# EAGLE design controller_v0 (EAGLE 7.3.0)
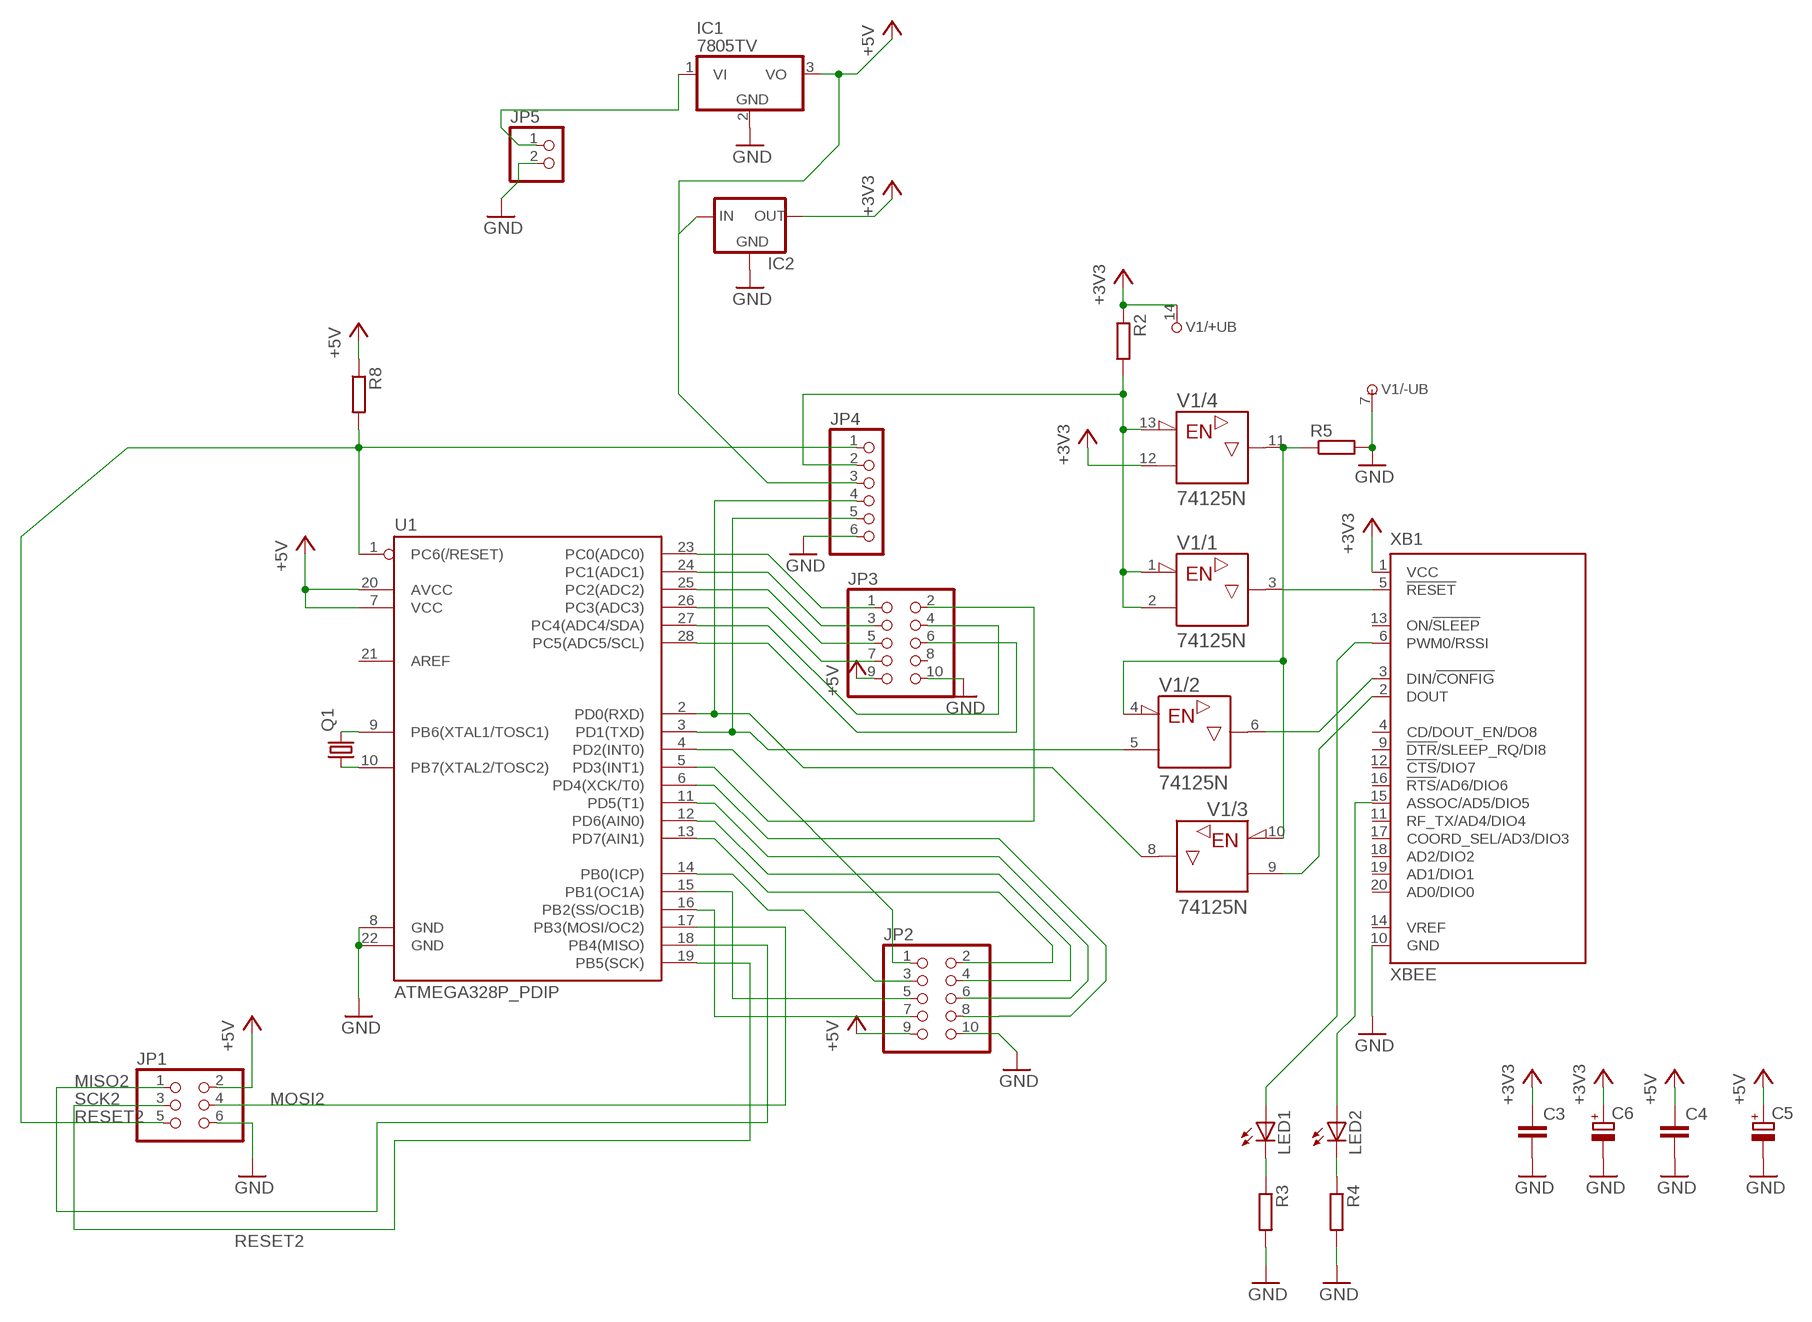
[diagram p0: schematic, sheet 1]

## Parts
C3  C-EU025-025X050  [C025-025X050]
C4  C-EU025-025X050  [C025-025X050]
C5  CPOL-EUE2.5-6  [E2,5-6]
C6  CPOL-EUE2.5-6  [E2,5-6]
IC1  7805TV  [TO220V]
IC2  78LXX  [78LXX]
JP1  PINHD-2X3  [2X03]
JP2  PINHD-2X5  [2X05]
JP3  PINHD-2X5  [2X05]
JP4  PINHD-1X6  [1X06]
JP5  PINHD-1X2  [1X02]
LED1  LED3MM  [LED3MM]
LED2  LED3MM  [LED3MM]
Q1  CRYSTALHC49S  [HC49/S]
R2  R-EU_0204/7  [0204/7]
R3  R-EU_0204/7  [0204/7]
R4  R-EU_0204/7  [0204/7]
R5  R-EU_0204/7  [0204/7]
R8  R-EU_0204/7  [0204/7]
U1  ATMEGA328P_PDIP  [DIL28-3]
V1  74125N  [DIL14]
XB1  XBEE  [XBEE]

## Nets
+3V3: C3.1 C6.+ IC2.OUT R2.1 V1.12(/4:A) V1.14(/+UB:+UB) XB1.1(VCC)
+5V: C4.1 C5.+ IC1.3(VO) IC2.IN JP1.2 JP2.9 JP3.9 JP4.3 R8.1 U1.7(VCC) U1.20(AVCC)
GND: C3.2 C4.2 C5.- C6.- IC1.2(GND) IC2.GND JP1.6 JP2.10 JP3.10 JP4.6 JP5.2 R3.2 R4.2 R5.2 U1.8(GND) U1.22(GND) V1.7(/-UB:-UB) XB1.10(GND)
MISO2: JP1.1 U1.18(PB4(MISO))
MOSI2: JP1.4 U1.17(PB3(MOSI/OC2))
N$1: Q1.2 U1.9(PB6(XTAL1/TOSC1))
N$2: Q1.1 U1.10(PB7(XTAL2/TOSC2))
N$3: V1.6(/2:Y) XB1.3(DIN/!CONFIG)
N$4: V1.3(/1:Y) XB1.5(!RESET)
N$5: LED2.A XB1.15(ASSOC/AD5/DIO5)
N$6: JP4.5 U1.3(PD1(TXD)) V1.5(/2:A)
N$7: LED1.K(C) R3.1
N$8: LED2.K(C) R4.1
N$9: LED1.A XB1.6(PWM0/RSSI)
N$11: JP4.4 U1.2(PD0(RXD)) V1.8(/3:Y)
N$12: V1.9(/3:A) XB1.2(DOUT)
N$13: R5.1 V1.4(/2:!G) V1.10(/3:!G) V1.11(/4:Y)
N$14: JP2.7 U1.16(PB2(SS/OC1B))
N$15: JP4.2 R2.2 V1.1(/1:!G) V1.2(/1:A) V1.13(/4:!G)
N$16: JP2.5 U1.15(PB1(OC1A))
N$17: JP2.1 U1.4(PD2(INT0))
N$18: JP2.4 U1.12(PD6(AIN0))
N$19: JP3.1 U1.23(PC0(ADC0))
N$20: JP3.3 U1.24(PC1(ADC1))
N$21: JP2.8 U1.6(PD4(XCK/T0))
N$22: JP3.2 U1.5(PD3(INT1))
N$23: JP3.5 U1.25(PC2(ADC2))
N$24: JP3.7 U1.26(PC3(ADC3))
N$25: JP3.4 U1.27(PC4(ADC4/SDA))
N$26: JP3.6 U1.28(PC5(ADC5/SCL))
N$27: JP2.6 U1.11(PD5(T1))
N$28: JP2.2 U1.13(PD7(AIN1))
N$29: JP2.3 U1.14(PB0(ICP))
N$30: IC1.1(VI) JP5.1
RESET2: JP1.5 JP4.1 R8.2 U1.1(PC6(/RESET))
SCK2: JP1.3 U1.19(PB5(SCK))
Unconnected: JP3.8 U1.21(AREF) XB1.4(CD/DOUT_EN/DO8) XB1.9(!DTR!/SLEEP_RQ/DI8) XB1.11(RF_TX/AD4/DIO4) XB1.12(!CTS!/DIO7) XB1.13(ON/!SLEEP) XB1.14(VREF) XB1.16(!RTS!/AD6/DIO6) XB1.17(COORD_SEL/AD3/DIO3) XB1.18(AD2/DIO2) XB1.19(AD1/DIO1) XB1.20(AD0/DIO0)

## Library data of the parts
C3 C4 = resistor:C-EU: CAPACITOR, European symbol
C5 C6 = resistor:CPOL-EU: POLARIZED CAPACITOR, European symbol
IC1 = linear:78*: Positive VOLTAGE REGULATOR Source: http://cache.national.com/ds/LM/LM78L05.pdf http://www.fairchildsemi.com/ds/LM/LM7805.pdf
IC2 = v-reg:78LXX: VOLTAGE REGULATOR
JP1 = pinhead:PINHD-2X3: PIN HEADER
JP2 JP3 = pinhead:PINHD-2X5: PIN HEADER
JP4 = pinhead:PINHD-1X6: PIN HEADER
JP5 = pinhead:PINHD-1X2: PIN HEADER
LED1 LED2 = led:LED: LED OSRAM: - CHIPLED LG R971, LG N971, LY N971, LG Q971, LY Q971, LO R971, LY R971 LH N974, LH R974 LS Q976, LO Q976, LY Q976 LO Q996 - Hyper CHIPLED LW Q18S LB Q993, LB Q99A, LB R99A - SideLED LS A670, LO A670, LY A670, LG A670, LP A670 LB A673, LV A673, LT A673, LW A673 LH A674 LY A675 LS A676, LA A676, LO A676, LY A676, LW A676 LS A679, LY A679, LG A679 - Hyper Micro SIDELED® LS Y876, LA Y876, LO Y876, LY Y876 LT Y87S - SmartLED LW L88C, LW L88S LB L89C, LB L89S, LG L890 LS L89K, LO L89K, LY L89K LS L896, LA L896, LO L896, LY L896 - TOPLED LS T670, LO T670, LY T670, LG T670, LP T670 LSG T670, LSP T670, LSY T670, LOP T670, LYG T670 LG T671, LOG T671, LSG T671 LB T673, LV T673, LT T673, LW T673 LH T674 LS T676, LA T676, LO T676, LY T676, LB T676, LH T676, LSB T676, LW T676 LB T67C, LV T67C, LT T67C, LS T67K, LO T67K, LY T67K, LW E67C LS E67B, LA E67B, LO E67B, LY E67B, LB E67C, LV E67C, LT E67C LW T67C LS T679, LY T679, LG T679 LS T770, LO T770, LY T770, LG T770, LP T770 LB T773, LV T773, LT T773, LW T773 LH T774 LS E675, LA E675, LY E675, LS T675 LS T776, LA T776, LO T776, LY T776, LB T776 LHGB T686 LT T68C, LB T68C - Hyper Mini TOPLED® LB M676 - Mini TOPLED Santana® LG M470 LS M47K, LO M47K, LY M47K Source: http://www.osram.convergy.de LUXEON: - LUMILED® LXK2-PW12-R00, LXK2-PW12-S00, LXK2-PW14-U00, LXK2-PW14-V00 LXK2-PM12-R00, LXK2-PM12-S00, LXK2-PM14-U00 LXK2-PE12-Q00, LXK2-PE12-R00, LXK2-PE12-S00, LXK2-PE14-T00, LXK2-PE14-U00 LXK2-PB12-K00, LXK2-PB12-L00, LXK2-PB12-M00, LXK2-PB14-N00, LXK2-PB14-P00, LXK2-PB14-Q00 LXK2-PR12-L00, LXK2-PR12-M00, LXK2-PR14-Q00, LXK2-PR14-R00 LXK2-PD12-Q00, LXK2-PD12-R00, LXK2-PD12-S00 LXK2-PH12-R00, LXK2-PH12-S00 LXK2-PL12-P00, LXK2-PL12-Q00, LXK2-PL12-R00 Source: www.luxeon.com KINGBRIGHT: KA-3528ASYC Source: www.kingbright.com
Q1 = crystal:CRYSTAL: CRYSTAL; OC_FARNELL: 1667008; OC_NEWARK: unknown
R2-R5 R8 = resistor:R-EU_: RESISTOR, European symbol
U1 = SparkFun-DigitalIC:ATMEGA328P_PDIP: uC used in the Arduino 32kb flash, 1k EEPROM, 2k SRAM This is the through-hole version of this chip.
V1 = 74ttl-din:74*125: Quad bus BUFFER, 3-state
XB1 = maxstream:XBEE: XBee (TM) /XBee-PRO(TM) OEM RF Modules Source: MaxStream, Inc. xbee_productmanual.pdf; MPN: XBP24-Z7UIT-004; OC_FARNELL: 1751799; OC_NEWARK: 34R5507

## Board
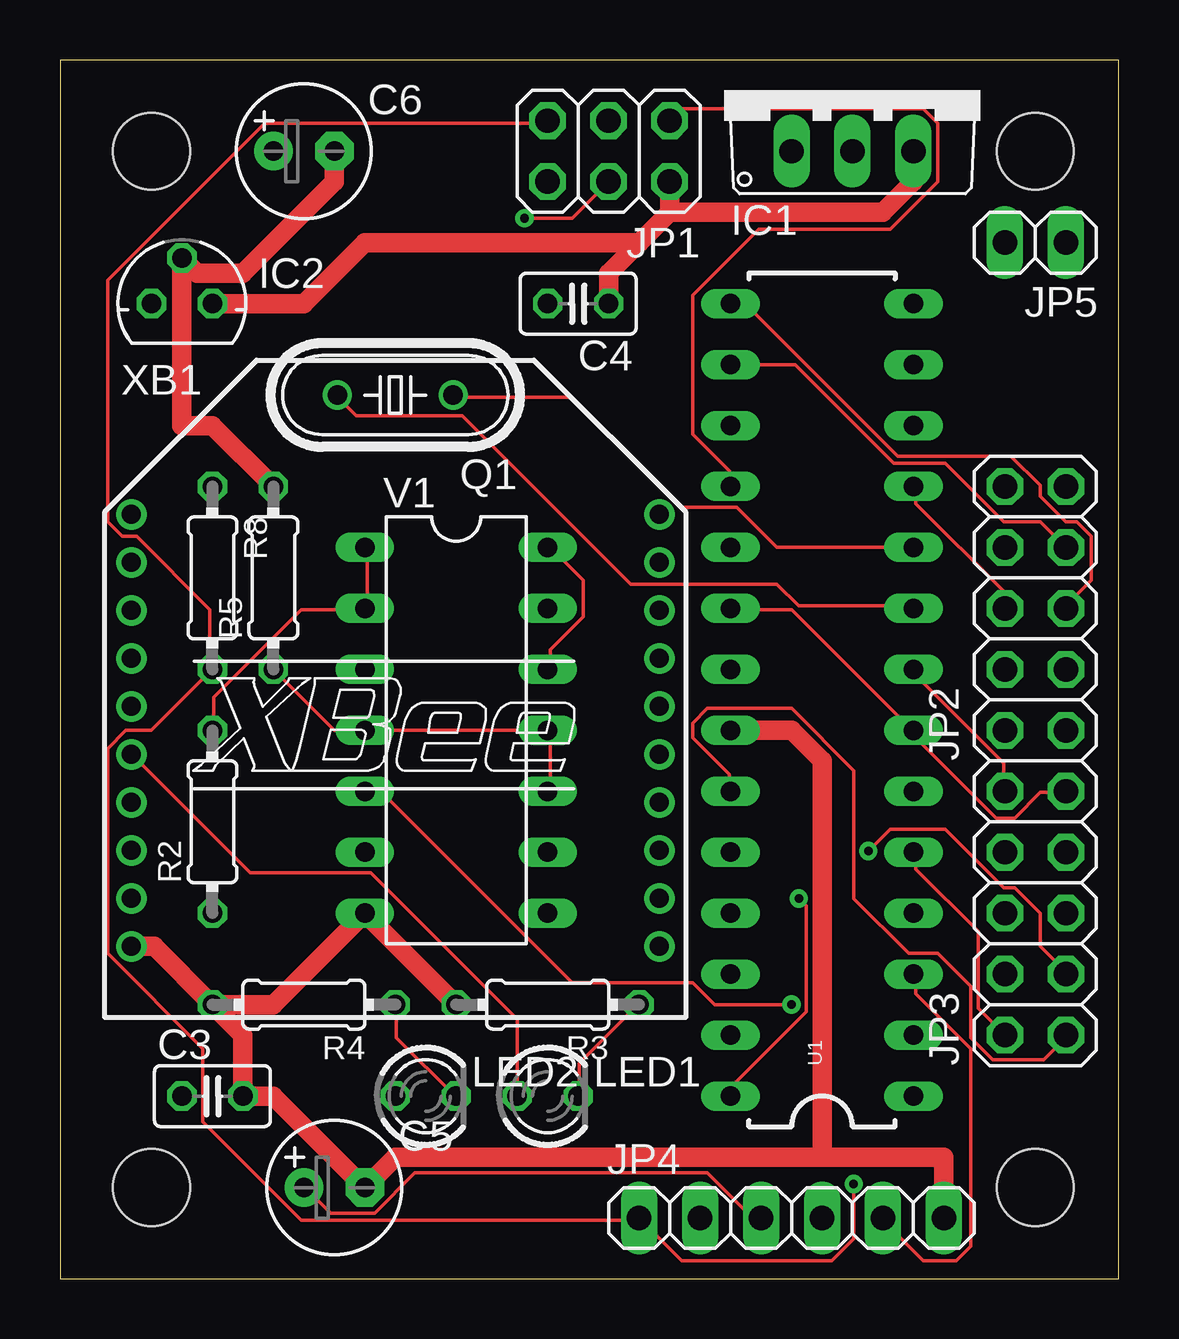
[diagram p1: board, top side]
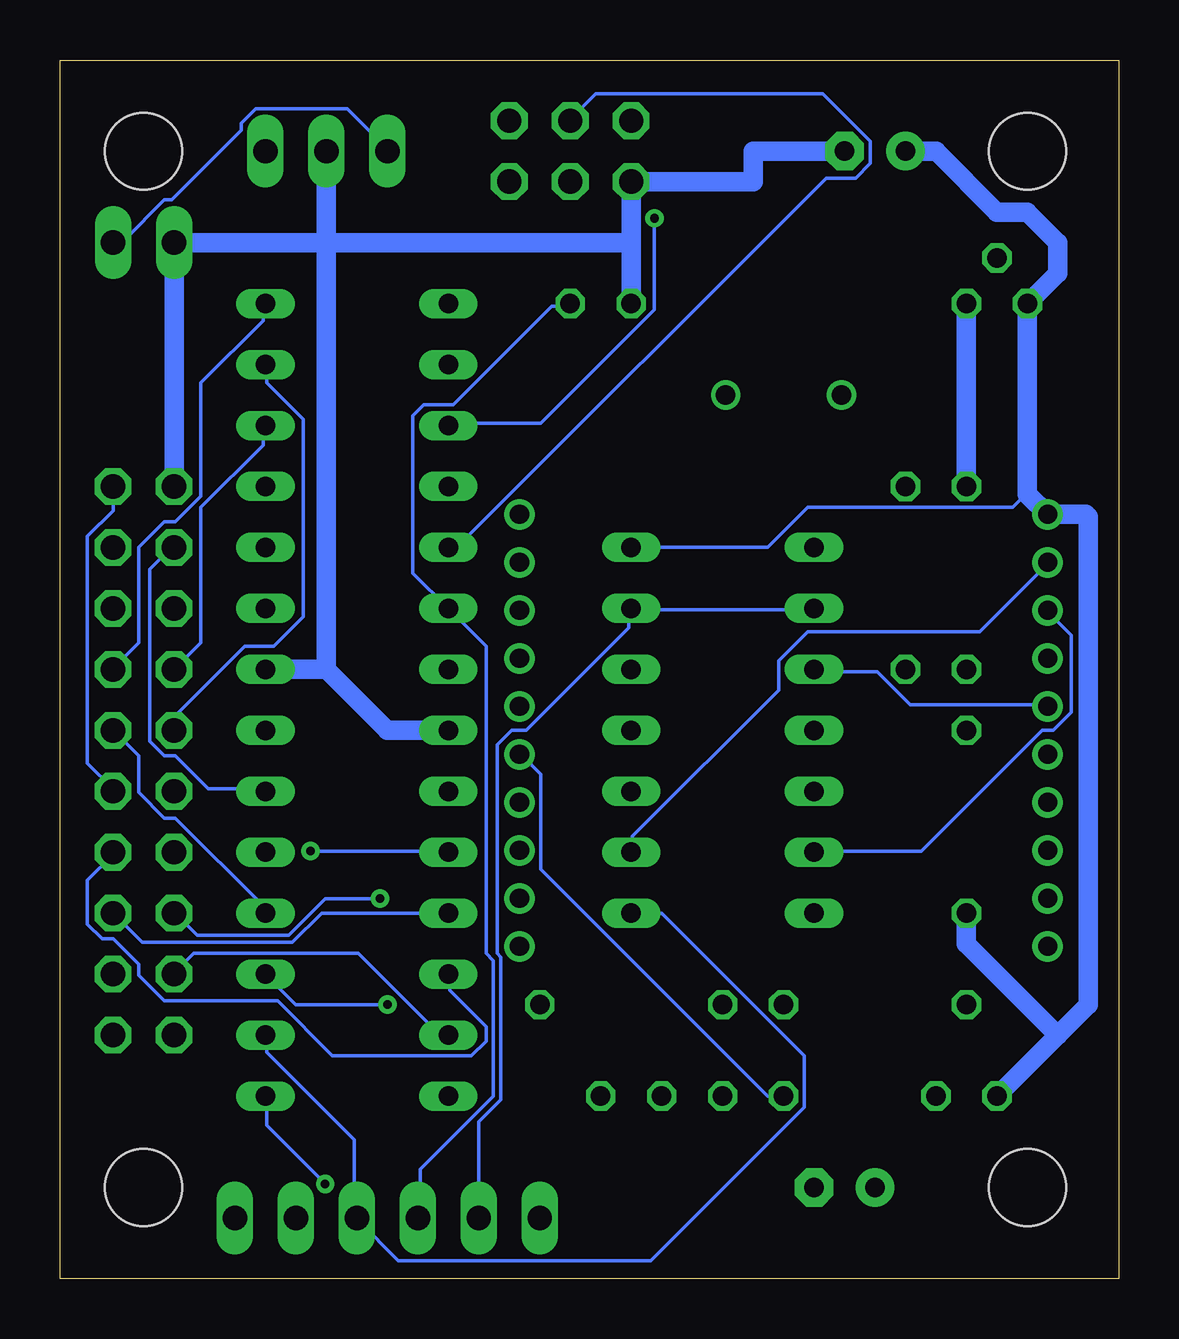
[diagram p2: board, bottom side, seen from below]

Size 44.12 x 50.79 mm. Coordinates in mm from the lower left corner, seen from the top.
Outline: 0,0 44.12,0 44.12,50.79 0,50.79 0,0
Copper layers (1*16): Top 0.0178mm / dielectric 59mil / Bottom 0.0178mm
Design rules "SSC-EAGLE-2Lyr_v1.0.0.3": minimum track width 6mil, minimum drill 14mil, track to track 6mil, track to pad 6mil, pad to pad 6mil, via to via 6mil, smd to smd 6mil, copper to edge 20mil, drill to drill 16mil, minimum pad ring 8mil, minimum via ring 8mil, stop-mask expansion 3mil, vias tented up to drill 0mil, thermal gap 10mil
Holes 3.2 mm at 40.64,3.81 40.64,46.99 3.81,46.99 3.81,3.81

### Footprints (pad centres in the part's own frame; a part is rotated, then mirrored left to right if it is on the bottom)
C025-025X050 = drill 0.813 octagon: 1 -1.27,0; 2 1.27,0
E2,5-6 = drill 0.813 pad 1.6: + -1.27,0 | drill 0.813 pad 1.6 octagon: - 1.27,0
TO220V = drill 1.016 long: 1 -2.54,-2.54; 2 0,-2.54; 3 2.54,-2.54
78LXX = drill 0.813 octagon: GND 0,1.905; IN 1.27,0; OUT -1.27,0
2X03 = drill 1.016 octagon: 1 -2.54,-1.27; 2 -2.54,1.27; 3 0,-1.27; 4 0,1.27; 5 2.54,-1.27; 6 2.54,1.27
2X05 = drill 1.016 octagon: 1 -5.08,-1.27; 2 -5.08,1.27; 3 -2.54,-1.27; 4 -2.54,1.27; 5 0,-1.27; 6 0,1.27; 7 2.54,-1.27; 8 2.54,1.27; 9 5.08,-1.27; 10 5.08,1.27
1X06 = drill 1.016 long: 1 -6.35,0; 2 -3.81,0; 3 -1.27,0; 4 1.27,0; 5 3.81,0; 6 6.35,0
1X02 = drill 1.016 long: 1 -1.27,0; 2 1.27,0
LED3MM = drill 0.813 octagon: A -1.27,0; K 1.27,0
HC49/S = drill 0.813: 1 -2.413,0; 2 2.413,0
0204/7 = drill 0.813 octagon: 1 -3.81,0; 2 3.81,0
DIL28-3 = drill 0.813 long: 1 -16.51,-3.81; 2 -13.97,-3.81; 3 -11.43,-3.81; 4 -8.89,-3.81; 5 -6.35,-3.81; 6 -3.81,-3.81; 7 -1.27,-3.81; 8 1.27,-3.81; 9 3.81,-3.81; 10 6.35,-3.81; 11 8.89,-3.81; 12 11.43,-3.81; 13 13.97,-3.81; 14 16.51,-3.81; 15 16.51,3.81; 16 13.97,3.81; 17 11.43,3.81; 18 8.89,3.81; 19 6.35,3.81; 20 3.81,3.81; 21 1.27,3.81; 22 -1.27,3.81; 23 -3.81,3.81; 24 -6.35,3.81; 25 -8.89,3.81; 26 -11.43,3.81; 27 -13.97,3.81; 28 -16.51,3.81
DIL14 = drill 0.813 long: 1 -7.62,-3.81; 2 -5.08,-3.81; 3 -2.54,-3.81; 4 0,-3.81; 5 2.54,-3.81; 6 5.08,-3.81; 7 7.62,-3.81; 8 7.62,3.81; 9 5.08,3.81; 10 2.54,3.81; 11 0,3.81; 12 -2.54,3.81; 13 -5.08,3.81; 14 -7.62,3.81
XBEE = drill 0.8 pad 1.27: 1 -11,9; 2 -11,7; 3 -11,5; 4 -11,3; 5 -11,1; 6 -11,-1; 7 -11,-3; 8 -11,-5; 9 -11,-7; 10 -11,-9; 11 11,-9; 12 11,-7; 13 11,-5; 14 11,-3; 15 11,-1; 16 11,1; 17 11,3; 18 11,5; 19 11,7; 20 11,9

### Placement (x,y rotation side)
C3  6.35,7.62 0 top
C4  21.59,40.64 180 top
C5  11.43,3.81 0 top
C6  10.16,46.99 0 top
IC1  33.02,49.53 0 top
IC2  5.08,40.64 0 top
JP1  22.86,46.99 180 top
JP2  40.64,27.94 90 top
JP3  40.64,15.24 90 top
JP4  30.48,2.54 0 top
JP5  40.64,43.18 180 top
LED1  20.32,7.62 0 top
LED2  15.24,7.62 0 top
Q1  13.97,36.83 180 top
R2  6.35,19.05 90 top
R3  20.32,11.43 180 top
R4  10.16,11.43 180 top
R5  8.89,29.21 90 top
R8  6.35,29.21 270 top
U1  31.75,24.13 90 top
V1  16.51,22.86 270 top
XB1  13.97,22.86 0 top

### Tracks (layer width: path | path; a pad name or v marks a point on that pad's centre or on a via)
+3V3
  Top 0.152: V1.12 20.42,25.45 20.42,26.21 21.79,27.58 21.79,29.11 20.42,30.48 V1.14
  Bottom 0.152: V1.14 14.63,30.48 12.95,32.16 4.42,32.16 4.12,32.46 3.81,32.7
  Bottom 0.813: C6.+ 7.62,46.99 5.08,44.45 3.81,44.45 2.54,43.18 2.54,41.91 IC2.OUT 3.81,32.7 XB1.1 1.38,31.86 1.27,31.75 1.27,11.43 2.54,10.16 | 2.54,10.16 C3.1 | R2.1 6.35,13.97 2.54,10.16
+5V
  Top 0.152: JP4.3 29.11,2.59 28.8,2.59 26.98,4.42 14.78,4.42 13.11,2.74 11.28,2.74 10.21,3.81 C5.+ | U1.20 28.04,27.89 30.48,27.89 35.51,22.86 U1.7 35.66,22.86 35.66,22.55 39.01,19.2 39.78,19.2 40.84,20.27 41.91,20.27 JP3.9
  Top 0.813: IC1.3 35.56,45.72 34.29,44.45 25.4,44.45 | 25.4,44.45 JP1.2 | C4.1 22.86,41.91 24.13,43.18 | 24.13,43.18 25.4,44.45 | IC2.IN 10.16,40.64 12.7,43.18 24.13,43.18
  Bottom 0.152: JP2.9 41.91,32 42.98,30.94 42.98,21.49 41.91,20.42 JP3.9 | JP4.3 29.11,2.59 29.11,4.57 26.06,7.62 26.06,13.26 26.36,13.56 26.36,26.36 U1.20 29.41,29.41 29.41,35.97 28.96,36.42 27.74,36.42 23.62,40.54 22.86,40.54 C4.1
  Bottom 0.813: IC2.IN R8.1
GND
  Top 0.152: JP3.10 39.32,20.42 39.32,21.49 35.51,25.3 U1.8
  Top 0.813: R4.2 7.62,10.16 C3.2 8.89,7.62 C5.- 13.97,5.08 31.75,5.08 | XB1.10 3.92,13.86 R4.2 | R4.2 8.89,11.43 V1.7 R3.2 | C6.- 11.43,45.72 7.62,41.91 5.71,41.91 IC2.GND 5.08,35.56 6.35,35.56 R5.2 | U1.22 30.48,22.86 31.75,21.59 31.75,5.08 | JP4.6 36.83,5.08 31.75,5.08
  Bottom 0.813: C6.- 15.24,46.99 15.24,45.72 JP1.6 20.32,43.18 | 20.32,43.18 C4.2 | JP2.10 JP5.2 33.02,43.18 | 33.02,43.18 33.02,25.4 | 33.02,25.4 U1.8 | 33.02,43.18 IC1.2 | 33.02,25.4 30.48,22.86 U1.22 | 20.32,43.18 33.02,43.18
MISO2
  Top 0.152: JP1.1 25.91,48.77 35.97,48.77 36.58,48.16 36.58,45.72 34.59,43.74 29.11,43.74 26.36,41 26.36,35.2 27.89,33.68 27.89,33.07 U1.18
MOSI2  (via drill 0.36)
  Top 0.152: v19.36,44.2 21.34,44.2 JP1.4
  Bottom 0.152: v19.36,44.2 19.36,40.39 24.08,35.66 27.89,35.66 U1.17
N$1
  Top 0.152: U1.9 35.51,28.04 30.79,28.04 29.87,28.96 23.77,28.96 16.76,35.97 12.34,35.97 11.58,36.73 Q1.2
N$2
  Top 0.152: U1.10 29.87,30.48 28.19,32.16 25.91,32.16 21.34,36.73 16.46,36.73 Q1.1
N$3
  Bottom 0.152: V1.6 12.65,17.83 8.23,17.83 3.2,22.86 2.74,22.86 1.98,23.62 1.98,26.82 2.9,27.74 XB1.3
N$4
  Bottom 0.152: V1.3 12.65,25.3 10.06,25.3 8.69,23.93 3.05,23.93 XB1.5
N$5
  Bottom 0.152: LED2.A 14.63,7.62 24.08,17.07 24.08,21.03 24.84,21.79 XB1.15
N$6  (via drill 0.36)
  Top 0.152: U1.3 35.66,12.65 35.66,11.89 37.95,9.6 37.95,1.37 37.34,0.76 35.97,0.76 34.29,2.44 JP4.5 | v30.48,11.43 27.28,11.43 26.36,12.34 21.34,12.34 13.41,20.27 12.8,20.27 V1.5
  Bottom 0.152: v30.48,11.43 34.29,11.43 U1.3
N$7
  Top 0.152: LED1.K 21.64,7.62 21.64,8.99 24.08,11.43 R3.1
N$8
  Top 0.152: R4.1 14.02,11.43 14.02,10.06 16.46,7.62 LED2.K
N$9
  Top 0.152: LED1.A 19.05,10.82 12.95,16.92 7.92,16.92 3.05,21.79 XB1.6
N$11
  Bottom 0.152: V1.8 19.05,15.24 13.11,9.3 13.11,7.16 19.51,0.76 30.02,0.76 31.7,2.44 JP4.4 31.85,2.59 31.85,5.79 35.51,9.45 35.51,10.06 U1.2
N$12
  Bottom 0.152: V1.9 20.27,17.83 20.27,18.44 14.17,24.54 14.17,25.76 12.95,26.98 5.79,26.98 3.05,29.72 XB1.2
N$13
  Top 0.152: V1.10 20.42,20.42 20.42,22.86 V1.11 V1.4 11.43,22.86 R5.1
N$14
  Top 0.152: U1.16 30.63,38.1 34.75,33.98 36.88,33.98 39.32,31.55 40.84,31.55 JP2.7
N$15
  Top 0.152: R2.2 6.4,22.86 6.4,24.23 10.06,27.89 12.65,27.89 V1.2 12.8,28.04 12.8,30.48 V1.1
  Bottom 0.152: V1.2 12.8,27.89 20.27,27.89 V1.13 20.42,27.89 20.42,27.13 24.69,22.86 25.3,22.86 25.91,22.25 25.91,13.56 25.76,13.41 25.76,7.47 26.67,6.55 JP4.2
N$16
  Top 0.152: U1.15 28.04,40.54 28.65,40.54 34.9,34.29 39.62,34.29 40.84,33.07 40.84,32.61 41.91,31.55 42.37,31.55 42.98,30.94 42.98,29.11 41.91,28.04 JP2.5
N$17
  Bottom 0.152: JP2.1 40.84,21.79 40.84,20.27 39.78,19.2 39.32,19.2 35.66,15.54 35.66,15.24 U1.4
N$18
  Bottom 0.152: JP2.4 38.25,26.52 38.25,32.16 35.66,34.75 35.66,35.51 U1.12
N$19
  Top 0.152: U1.23 27.89,20.42 27.89,21.03 26.36,22.55 26.36,23.16 26.98,23.77 30.48,23.77 33.07,21.18 33.07,15.85 35.36,13.56 36.58,13.56 37.95,12.19 37.95,10.06 38.86,9.14 41,9.14 41.91,10.06 JP3.1
N$20  (via drill 0.36)
  Top 0.152: v33.68,17.83 34.59,18.75 36.88,18.75 39.32,16.31 39.78,16.31 40.84,15.24 40.84,13.87 41.91,12.8 JP3.3
  Bottom 0.152: v33.68,17.83 28.04,17.83 U1.24
N$21
  Bottom 0.152: U1.6 35.66,20.42 37.95,20.42 39.32,21.79 39.78,21.79 40.39,22.4 40.39,29.57 39.47,30.48 JP2.8
N$22
  Top 0.152: JP3.2 38.25,11.28 38.25,14.48 35.66,17.07 35.66,17.68 U1.5
N$23
  Bottom 0.152: U1.25 33.22,15.24 34.44,14.02 40.69,14.02 JP3.5
N$24
  Bottom 0.152: U1.26 27.89,12.65 27.89,12.04 26.36,10.52 26.36,9.91 26.98,9.3 32.77,9.3 35.05,11.58 39.78,11.58 40.84,12.65 40.84,13.11 41.91,14.17 42.37,14.17 42.98,14.78 42.98,16.61 41.91,17.68 JP3.7
N$25
  Bottom 0.152: U1.27 28.04,10.21 28.35,10.21 31.7,13.56 38.56,13.56 39.32,12.8 JP3.4
N$26  (via drill 0.36)
  Top 0.152: v30.79,15.85 31.09,15.54 31.09,11.12 28.04,8.08 28.04,7.62 U1.28
  Bottom 0.152: v30.79,15.85 33.07,15.85 34.59,14.33 38.41,14.33 39.32,15.24 JP3.6
N$27
  Top 0.152: U1.11 35.66,32.92 35.66,32.31 39.32,28.65 39.32,28.04 JP2.6
N$28
  Bottom 0.152: U1.13 35.51,38.1 35.51,37.34 33.98,35.81 33.98,27.58 35.2,26.36 36.42,26.36 39.32,23.47 39.32,22.86 JP2.2
N$29
  Bottom 0.152: U1.14 35.66,40.54 35.66,39.93 38.25,37.34 38.25,32.61 39.32,31.55 39.78,31.55 40.84,30.48 40.84,26.52 41.91,25.45 JP2.3
N$30
  Bottom 0.152: JP5.1 41.91,43.28 41.45,43.28 39.78,44.96 39.47,44.96 36.58,47.85 36.58,48.16 35.97,48.77 32.16,48.77 30.48,47.09 IC1.1
RESET2  (via drill 0.36)
  Top 0.152: v33.07,3.96 33.07,1.68 32.16,0.76 25.91,0.76 JP4.1 24.08,2.44 10.06,2.44 5.94,6.55 5.94,9.6 1.98,13.56 1.98,22.1 2.74,22.86 3.81,22.86 R8.2 6.25,25.45 6.25,27.89 3.2,30.94 2.59,30.94 1.98,31.55 1.98,41.6 8.53,48.16 20.27,48.16 JP1.5
  Bottom 0.152: v33.07,3.96 35.51,6.4 35.51,7.62 U1.1
SCK2
  Bottom 0.152: U1.19 27.58,30.48 12.19,45.87 10.97,45.87 10.36,46.48 10.36,47.4 12.34,49.38 21.79,49.38 22.86,48.31 JP1.3